# EAGLE design HVC-NROM (EAGLE 9.3.0)
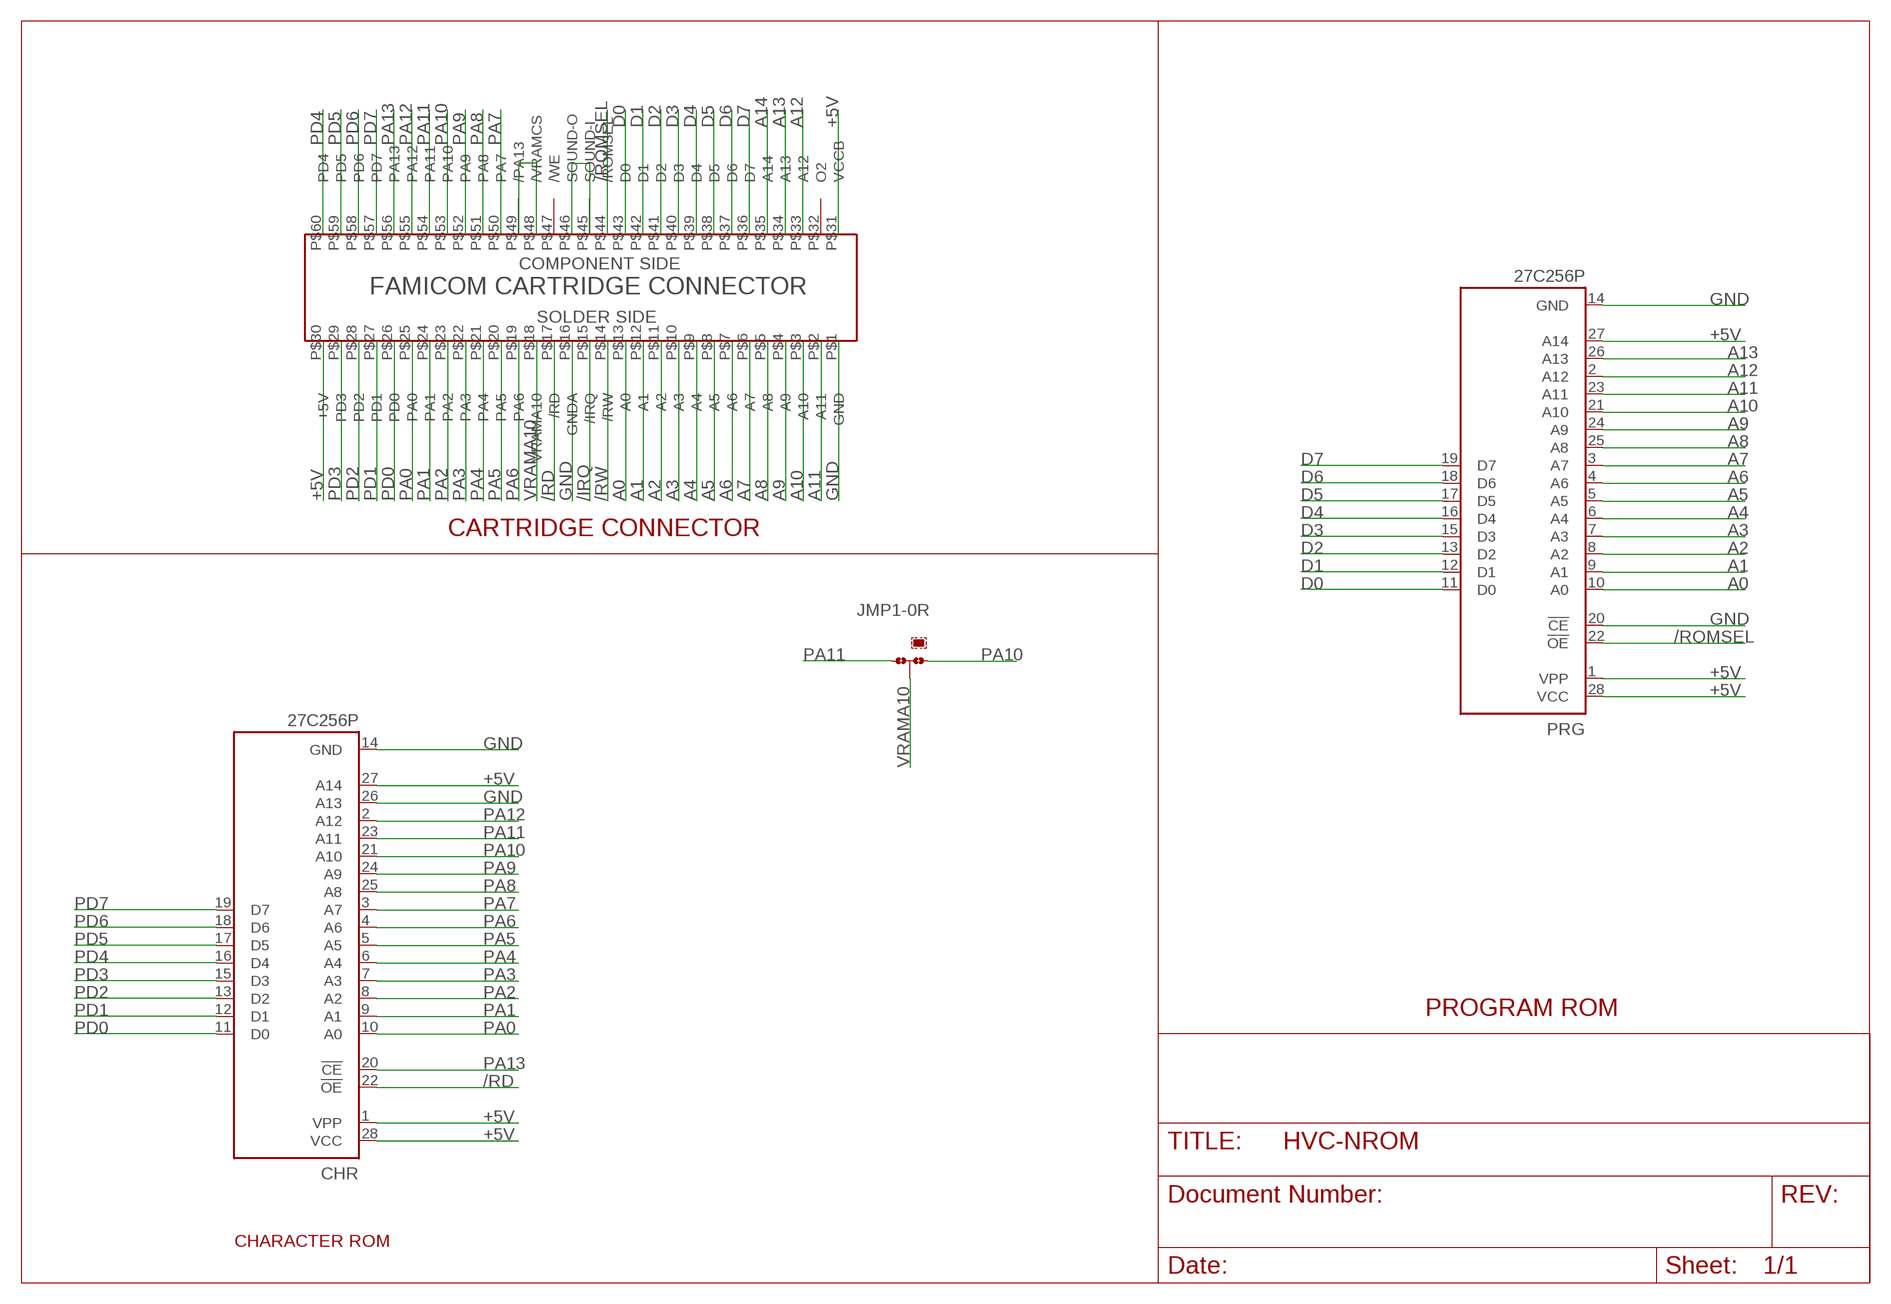
[diagram p0: schematic, sheet 1]

## Parts
CHR  27C256P  [DIL28-6]
JMP1  0R-JUMPA  [A0R-JMP]
PRG  27C256P  [DIL28-6]
U$1  FC-60-CART-PIN  [FC-60-PIN-CART]

## Nets
+5V: CHR.1(VPP) CHR.27(A14) CHR.28(VCC) PRG.1(VPP) PRG.27(A14) PRG.28(VCC) U$1.P$30(+5V) U$1.P$31(VCCB)
/IRQ: U$1.P$15(/IRQ)
/RD: CHR.22(!OE) U$1.P$17(/RD)
/ROMSEL: PRG.22(!OE) U$1.P$44(/ROMSEL)
/RW: U$1.P$14(/RW)
A0: PRG.10(A0) U$1.P$13(A0)
A1: PRG.9(A1) U$1.P$12(A1)
A2: PRG.8(A2) U$1.P$11(A2)
A3: PRG.7(A3) U$1.P$10(A3)
A4: PRG.6(A4) U$1.P$9(A4)
A5: PRG.5(A5) U$1.P$8(A5)
A6: PRG.4(A6) U$1.P$7(A6)
A7: PRG.3(A7) U$1.P$6(A7)
A8: PRG.25(A8) U$1.P$5(A8)
A9: PRG.24(A9) U$1.P$4(A9)
A10: PRG.21(A10) U$1.P$3(A10)
A11: PRG.23(A11) U$1.P$2(A11)
A12: PRG.2(A12) U$1.P$33(A12)
A13: PRG.26(A13) U$1.P$34(A13)
A14: U$1.P$35(A14)
D0: PRG.11(D0) U$1.P$43(D0)
D1: PRG.12(D1) U$1.P$42(D1)
D2: PRG.13(D2) U$1.P$41(D2)
D3: PRG.15(D3) U$1.P$40(D3)
D4: PRG.16(D4) U$1.P$39(D4)
D5: PRG.17(D5) U$1.P$38(D5)
D6: PRG.18(D6) U$1.P$37(D6)
D7: PRG.19(D7) U$1.P$36(D7)
GND: CHR.14(GND) CHR.26(A13) PRG.14(GND) PRG.20(!CE) U$1.P$1(GND) U$1.P$16(GNDA)
N$1: U$1.P$45(SOUND-I) U$1.P$46(SOUND-O)
N$2: U$1.P$48(/VRAMCS) U$1.P$49(/PA13)
PA0: CHR.10(A0) U$1.P$25(PA0)
PA1: CHR.9(A1) U$1.P$24(PA1)
PA2: CHR.8(A2) U$1.P$23(PA2)
PA3: CHR.7(A3) U$1.P$22(PA3)
PA4: CHR.6(A4) U$1.P$21(PA4)
PA5: CHR.5(A5) U$1.P$20(PA5)
PA6: CHR.4(A6) U$1.P$19(PA6)
PA7: CHR.3(A7) U$1.P$50(PA7)
PA8: CHR.25(A8) U$1.P$51(PA8)
PA9: CHR.24(A9) U$1.P$52(PA9)
PA10: CHR.21(A10) JMP1.1 U$1.P$53(PA10)
PA11: CHR.23(A11) JMP1.3 U$1.P$54(PA11)
PA12: CHR.2(A12) U$1.P$55(PA12)
PA13: CHR.20(!CE) U$1.P$56(PA13)
PD0: CHR.11(D0) U$1.P$26(PD0)
PD1: CHR.12(D1) U$1.P$27(PD1)
PD2: CHR.13(D2) U$1.P$28(PD2)
PD3: CHR.15(D3) U$1.P$29(PD3)
PD4: CHR.16(D4) U$1.P$60(PD4)
PD5: CHR.17(D5) U$1.P$59(PD5)
PD6: CHR.18(D6) U$1.P$58(PD6)
PD7: CHR.19(D7) U$1.P$57(PD7)
VRAMA10: JMP1.2 U$1.P$18(VRAMA10)
Unconnected: U$1.P$32(O2) U$1.P$47(/WE)

## Notes on the sheet
- CARTRIDGE CONNECTOR
- PROGRAM ROM
- CHARACTER ROM

## Library data of the parts
CHR PRG = microchip:27*256: CMOS EPROM 256 K (32 K x 8), low voltage; MF: Arrow Electronics; MPN: M27C256B15F1; OC_FARNELL: 1125431; OC_NEWARK: 93K7335
JMP1 = jump-0r-smd:0R-JUMP: SMD 0R 0805 Jumper
U$1 = FC LIBR:FC-60-CART-PIN: FAMICOM Cart Connector - W/NROM

## Board
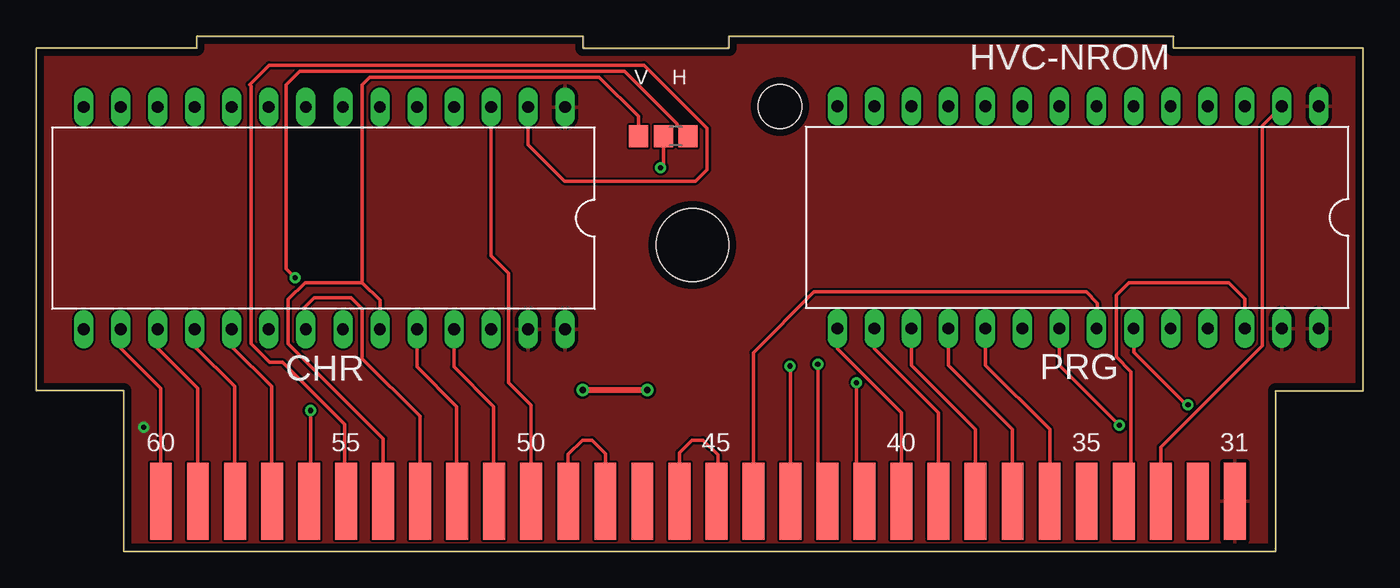
[diagram p1: board, top side]
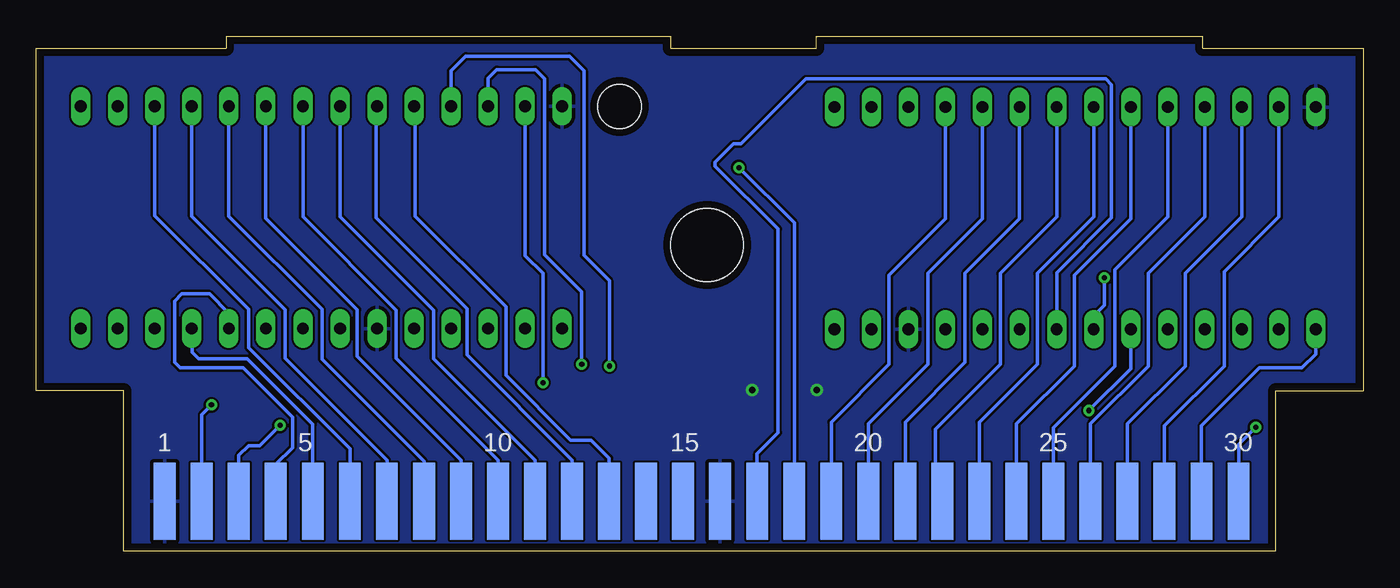
[diagram p2: board, bottom side, seen from below]

Size 91 x 35.3 mm. Coordinates in mm from the lower left corner, seen from the top.
Outline: 6,0 6,11 0,11 0,34.5 11,34.5 11,35.3 37.5,35.3 37.5,34.5 47.5,34.5 47.5,35.3 78,35.3 78,34.5 91,34.5 91,11 85,11 85,0 6,0
Copper layers (1*16): Top 0.035mm / dielectric 1.5mm / Bottom 0.035mm
Design rules "default *": minimum track width 6mil, minimum drill 0.35mm, track to track 6mil, track to pad 6mil, pad to pad 6mil, via to via 6mil, smd to smd 6mil, copper to edge 0.5mm, drill to drill 6mil, minimum pad ring 10mil, minimum via ring 8mil, stop-mask expansion 4mil, vias tented up to drill 0mil, thermal gap 10mil

### Footprints (pad centres in the part's own frame; a part is rotated, then mirrored left to right if it is on the bottom)
DIL28-6 = drill 0.813 long: 1 -16.51,-7.62; 2 -13.97,-7.62; 3 -11.43,-7.62; 4 -8.89,-7.62; 5 -6.35,-7.62; 6 -3.81,-7.62; 7 -1.27,-7.62; 8 1.27,-7.62; 9 3.81,-7.62; 10 6.35,-7.62; 11 8.89,-7.62; 12 11.43,-7.62; 13 13.97,-7.62; 14 16.51,-7.62; 15 16.51,7.62; 16 13.97,7.62; 17 11.43,7.62; 18 8.89,7.62; 19 6.35,7.62; 20 3.81,7.62; 21 1.27,7.62; 22 -1.27,7.62; 23 -3.81,7.62; 24 -6.35,7.62; 25 -8.89,7.62; 26 -11.43,7.62; 27 -13.97,7.62; 28 -16.51,7.62
A0R-JMP = smd 1.5 x 1.3: 1 0,1.7; 2 0,0; 3 0,-1.7
FC-60-PIN-CART = smd 1.5 x 5.25 bottom: P$1 76.2,3.429; P$2 73.66,3.429; P$3 71.12,3.429; P$4 68.58,3.429; P$5 66.04,3.429; P$6 63.5,3.429; P$7 60.96,3.429; P$8 58.42,3.429; P$9 55.88,3.429; P$10 53.34,3.429; P$11 50.8,3.429; P$12 48.26,3.429; P$13 45.72,3.429; P$14 43.18,3.429; P$15 40.64,3.429; P$16 38.1,3.429; P$17 35.56,3.429; P$18 33.02,3.429; P$19 30.48,3.429; P$20 27.94,3.429; P$21 25.4,3.429; P$22 22.86,3.429; P$23 20.32,3.429; P$24 17.78,3.429; P$25 15.24,3.429; P$26 12.7,3.429; P$27 10.16,3.429; P$28 7.62,3.429; P$29 5.08,3.429; P$30 2.54,3.429 | smd 1.5 x 5.25: P$31 76.2,3.429; P$32 73.66,3.429; P$33 71.12,3.429; P$34 68.58,3.429; P$35 66.04,3.429; P$36 63.5,3.429; P$37 60.96,3.429; P$38 58.42,3.429; P$39 55.88,3.429; P$40 53.34,3.429; P$41 50.8,3.429; P$42 48.26,3.429; P$43 45.72,3.429; P$44 43.18,3.429; P$45 40.64,3.429; P$46 38.1,3.429; P$47 35.56,3.429; P$48 33.02,3.429; P$49 30.48,3.429; P$50 27.94,3.429; P$51 25.4,3.429; P$52 22.86,3.429; P$53 20.32,3.429; P$54 17.78,3.429; P$55 15.24,3.429; P$56 12.7,3.429; P$57 10.16,3.429; P$58 7.62,3.429; P$59 5.08,3.429; P$60 2.54,3.429 | hole 3: 45,30.5 | hole 5: 39,21

### Placement (x,y rotation side)
CHR  19.75,22.84 180 top
JMP1  43,28.46 270 top
PRG  71.45,22.89 180 top
U$1  6,0 0 top

### Tracks (layer width: path | path; a pad name or v marks a point on that pad's centre or on a via)
+5V  (via drill 0.35)
  Bottom 0.254: U$1.P$30 8.54,7.33 v7.37,8.51
  pour Top: 0,34.5 11,34.5 11,35.3 37.5,35.3 37.5,34.5 47.5,34.5 47.5,35.3 78,35.3 78,34.5 91,34.5 91,11 85,11 85,0 6,0 6,11 0,11
/RD
  Bottom 0.254: U$1.P$17 41.56,6.7 40.13,8.13 40.13,22.1 44.45,26.42 44.45,26.67 43.18,27.94 42.67,27.94 38.23,32.38 17.65,32.38 17.27,32 17.27,22.86 21.02,19.11 CHR.22
/ROMSEL
  Top 0.254: U$1.P$44 49.18,13.62 53.34,17.78 72.01,17.78 72.77,17.02 72.77,15.32 PRG.22
A0
  Bottom 0.254: U$1.P$13 51.72,6.38 52.96,7.62 54.36,7.62 58.8,12.06 58.8,16.76 65.02,22.99 65.02,30.43 PRG.10
A1
  Bottom 0.254: U$1.P$12 54.26,6.25 61.47,13.46 61.47,16.64 67.69,22.86 67.69,30.46 PRG.9
A2
  Bottom 0.254: U$1.P$11 56.8,6.25 63.75,13.21 63.75,16.51 70.18,22.94 PRG.8
A3
  Bottom 0.254: U$1.P$10 59.34,6.25 66.32,13.23 66.32,16.54 72.72,22.94 PRG.7
A4
  Bottom 0.254: U$1.P$9 61.88,6.25 68.99,13.36 68.99,16.57 75.26,22.85 PRG.6
A5
  Bottom 0.254: U$1.P$8 64.42,6.18 71.42,13.18 71.42,16.59 77.8,22.97 PRG.5
A6
  Bottom 0.254: U$1.P$7 66.96,6.25 73.94,13.23 73.94,16.57 80.34,22.97 PRG.4
A7
  Bottom 0.254: U$1.P$6 69.5,7.02 76.45,13.97 76.45,16.59 82.88,23.02 PRG.3
A8
  Bottom 0.254: U$1.P$5 72.04,8.71 76.54,13.21 79.88,13.21 80.33,13.65 80.33,15.26 PRG.25
A9
  Bottom 0.254: PRG.24 77.8,16.33 79.12,17.65 81.03,17.65 81.53,17.14 81.53,12.95 81.15,12.57 76.83,12.57 73.44,9.18 73.44,7.11 74.58,5.97 U$1.P$4
A10  (via drill 0.35)
  Top 0.254: PRG.21 70.18,12.75 v74.3,8.64
  Bottom 0.254: U$1.P$3 77.12,6.57 76.45,7.24 75.69,7.24 v74.3,8.64
A11  (via drill 0.35)
  Top 0.254: PRG.23 75.26,13.64 78.87,10.03 v78.99,10.03
  Bottom 0.254: v78.99,10.03 79.66,9.37 U$1.P$2
A12
  Top 0.254: U$1.P$33 77.12,7.14 84.07,14.1 84.07,29.16 PRG.2
A13
  Top 0.254: U$1.P$34 75.09,3.94 75.09,12.32 74.07,13.34 74.07,17.55 74.93,18.41 81.79,18.41 82.88,17.32 PRG.26
D0  (via drill 0.35)
  Top 0.254: U$1.P$43 51.72,12.67 v51.69,12.7
  Bottom 0.254: PRG.11 62.56,32.94 61.55,33.96 54.44,33.96 53.44,32.96 53.44,20.3 51.69,18.54 v51.69,12.7
D1  (via drill 0.35)
  Top 0.254: v53.59,12.83 53.62,12.8 53.62,4.06 U$1.P$42
  Bottom 0.254: PRG.12 60.02,32.44 59.44,33.02 56.77,33.02 56.13,32.38 56.13,20.32 53.59,17.78 v53.59,12.83
D2  (via drill 0.35)
  Top 0.254: v56.26,11.56 56.26,3.97 U$1.P$41
  Bottom 0.254: PRG.13 57.48,20.27 56.26,19.05 v56.26,11.56
D3
  Top 0.254: PRG.15 54.94,13.89 59.34,9.49 U$1.P$40
D4
  Top 0.254: PRG.16 57.48,13.89 61.88,9.49 U$1.P$39
D5
  Top 0.254: PRG.17 60.02,12.75 64.42,8.35 U$1.P$38
D6
  Top 0.254: PRG.18 62.56,12.75 66.96,8.35 U$1.P$37
D7
  Top 0.254: PRG.19 65.1,12.75 69.5,8.35 U$1.P$36
GND  (via drill 0.45)
  Top 0.406: v41.91,11.05 v37.47,11.05
  pour Bottom: 0,34.5 11,34.5 11,35.3 37.5,35.3 37.5,34.5 47.5,34.5 47.5,35.3 78,35.3 78,34.5 91,34.5 91,11 85,11 85,0 6,0 6,11 0,11
N$1
  Top 0.254: U$1.P$46 44.1,6.76 44.96,7.62 45.72,7.62 46.74,6.6 46.74,3.52 U$1.P$45
N$2
  Top 0.254: U$1.P$49 36.48,6.63 37.47,7.62 38.1,7.62 39.02,6.7 U$1.P$48
PA0
  Bottom 0.254: CHR.10 13.4,22.92 17.02,19.3 17.02,12.7 21.24,8.48 U$1.P$25
PA1
  Bottom 0.254: CHR.9 15.94,22.8 19.81,18.92 19.81,12.7 23.78,8.73 U$1.P$24
PA2
  Bottom 0.254: CHR.8 18.48,22.92 22.35,19.05 22.35,12.83 26.32,8.86 U$1.P$23
PA3
  Bottom 0.254: CHR.7 21.02,22.92 24.89,19.05 24.89,12.83 29.34,8.38 29.34,3.91 U$1.P$22
PA4
  Bottom 0.254: CHR.6 23.56,22.8 27.3,19.05 27.3,12.95 31.4,8.86 U$1.P$21
PA5
  Bottom 0.254: CHR.5 26.1,22.8 29.84,19.05 29.84,12.83 33.94,8.73 U$1.P$20
PA6
  Bottom 0.254: CHR.4 28.64,22.8 32.51,18.92 32.51,12.83 36.48,8.86 U$1.P$19
PA7
  Top 0.254: CHR.3 31.18,20.25 32.38,19.05 32.38,11.56 33.94,10 U$1.P$50
PA8
  Top 0.254: CHR.25 28.64,12.63 31.37,9.91 31.37,3.46 U$1.P$51
PA9
  Top 0.254: CHR.24 26.1,12.63 28.83,9.91 28.83,3.46 U$1.P$52
PA10  (via drill 0.35)
  Top 0.254: U$1.P$53 26.32,9.24 22.35,13.21 22.35,16.64 21.59,17.4 19.05,17.4 18.35,16.7 18.35,15.35 CHR.21 | JMP1.1 43.93,29.23 43.93,29.33 40.34,32.92 18.06,32.92 17.14,32 17.14,20.32 17.14,19.36 v17.75,18.75
  Bottom 0.152: 18.38,15.25 18.38,16.25
  Bottom 0.254: v17.75,18.75 17.75,16.88 18.38,16.25 | CHR.21 18.45,15.25 18.38,15.25
PA11
  Top 0.254: U$1.P$54 23.78,7.72 17.27,14.22 17.27,17.27 18.41,18.41 22.35,18.41 | CHR.23 23.56,17.21 22.35,18.41 | JMP1.3 41.3,29.82 38.61,32.51 22.86,32.51 22.35,32 22.35,18.41
PA12
  Top 0.254: CHR.2 33.72,27.88 36.22,25.38 45.21,25.38 46,26.16 46,29 41.67,33.33 15.95,33.33 14.62,32 14.73,31.9 14.73,14.22 16,12.95 16.89,12.95 21.12,8.72 21.12,3.54 U$1.P$55
PA13  (via drill 0.35)
  Top 0.254: v18.8,9.65 18.8,3.52 U$1.P$56
  Bottom 0.254: CHR.20 15.94,12.51 v18.8,9.65
PD0
  Bottom 0.254: CHR.11 10.86,22.92 14.73,19.05 14.73,12.7 18.7,8.73 U$1.P$26
PD1
  Bottom 0.254: CHR.12 8.32,22.92 12.19,19.05 12.19,12.7 16.16,8.73 U$1.P$27
PD2
  Bottom 0.254: CHR.13 5.78,22.92 9.53,19.18 9.53,12.7 13.62,8.61 U$1.P$28
PD3
  Bottom 0.254: CHR.15 3.24,13.52 4.19,12.57 7.11,12.57 11.08,8.61 U$1.P$29
PD4
  Top 0.254: CHR.16 5.78,13.9 8.51,11.18 8.51,3.46 U$1.P$60
PD5
  Top 0.254: CHR.17 8.32,13.9 11.05,11.18 11.05,3.46 U$1.P$59
PD6
  Top 0.254: CHR.18 10.86,14.03 13.59,11.3 13.59,3.46 U$1.P$58
PD7
  Top 0.254: CHR.19 13.4,14.03 16.13,11.3 16.13,3.46 U$1.P$57
VRAMA10  (via drill 0.35)
  Top 0.254: JMP1.2 43,26.49 v42.82,26.31
  Bottom 0.254: v42.82,26.31 39.02,22.51 U$1.P$18

### Text on the board
tPlace: HVC-NROM | V H